# EAGLE design diskohedron4w_reve (EAGLE 7.0.0)
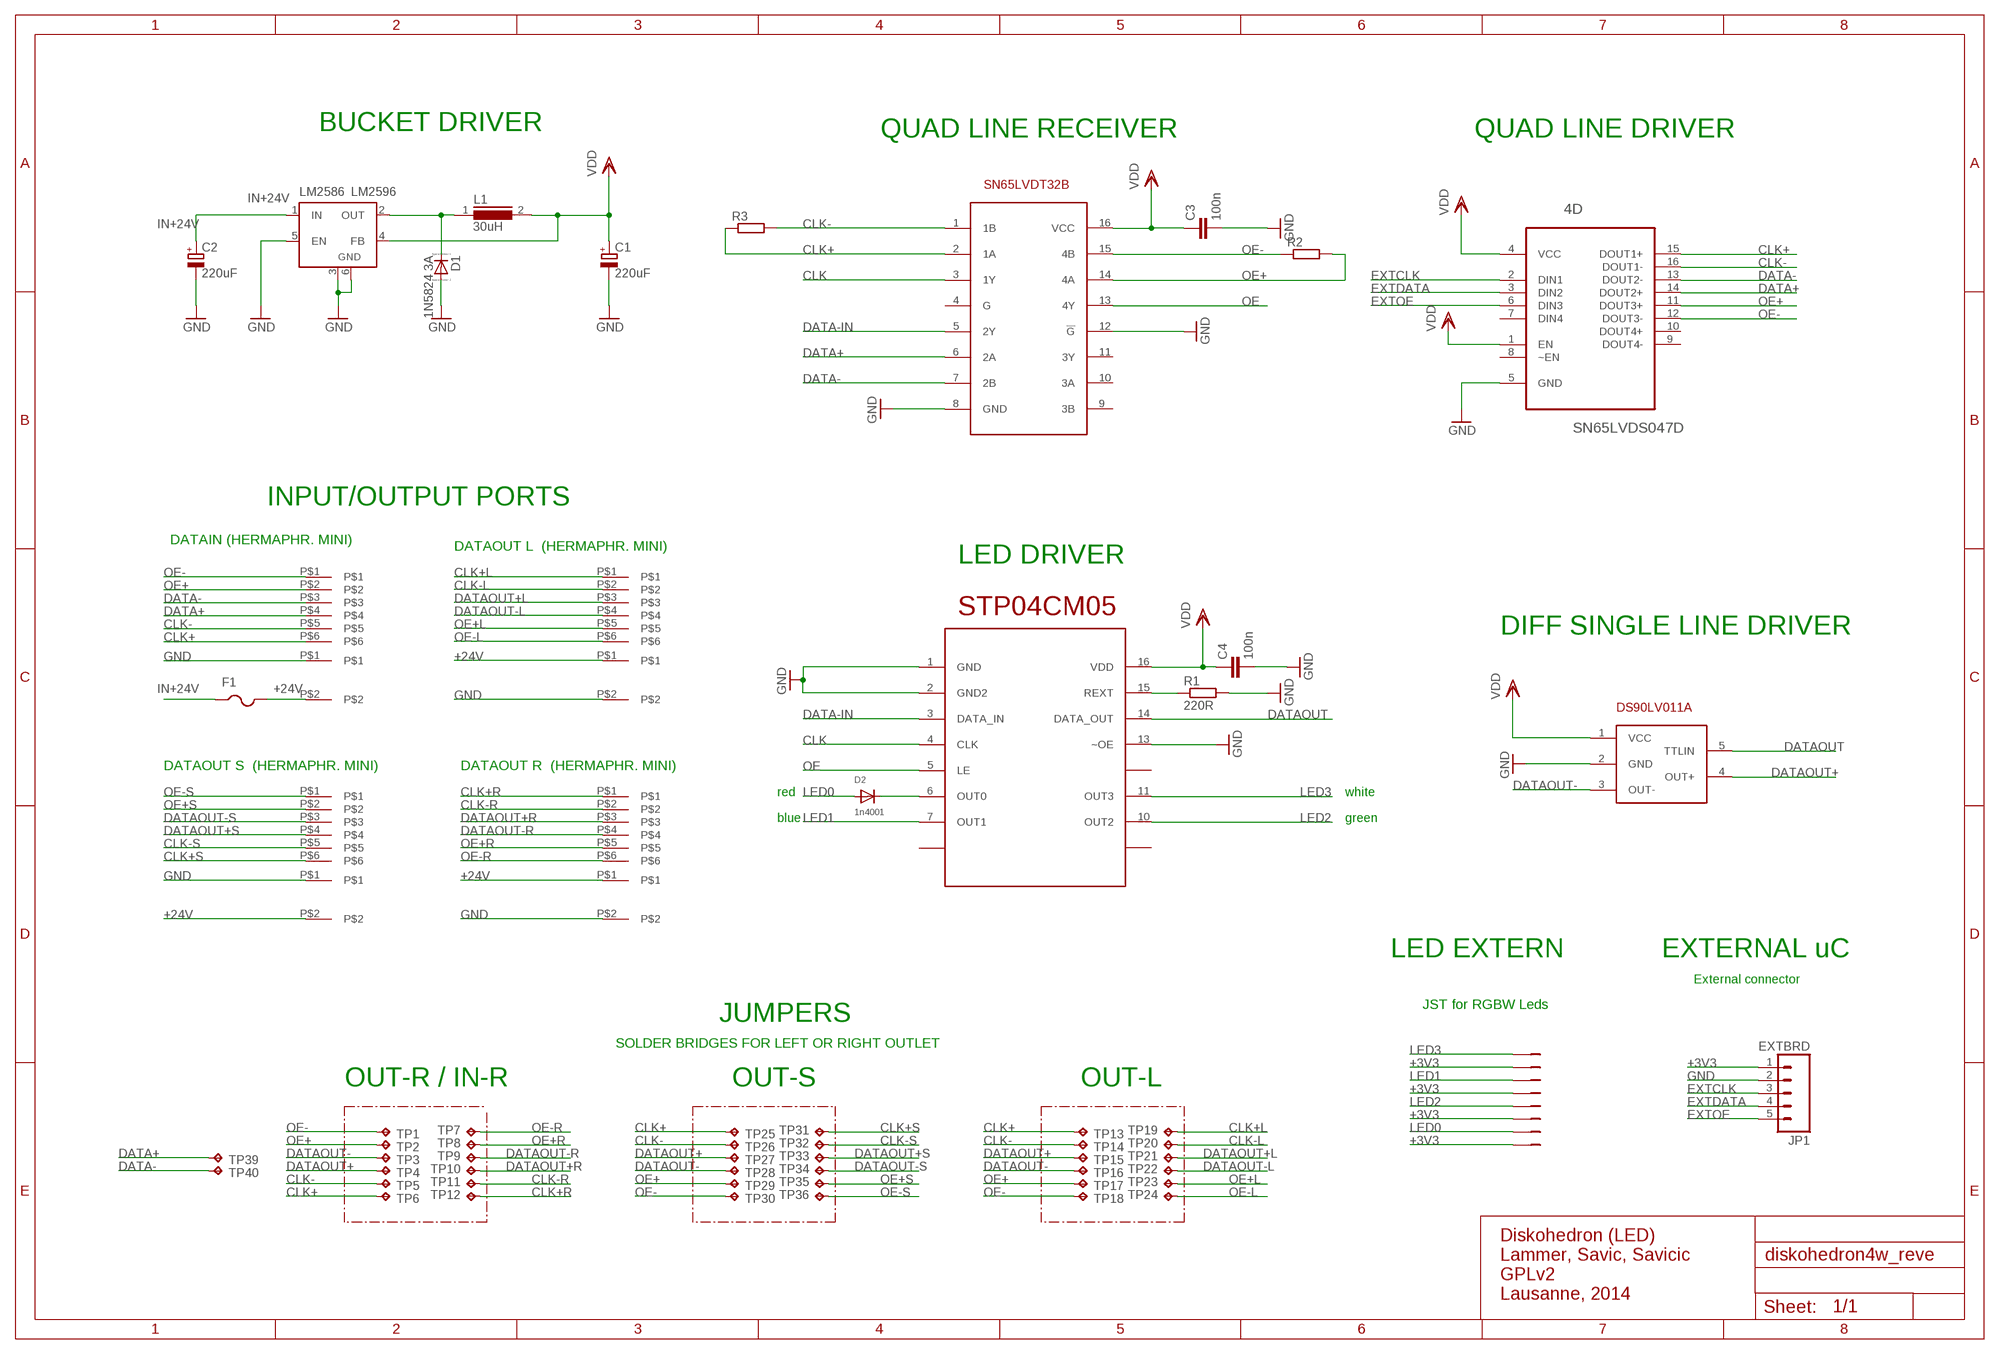
[diagram p0: schematic, sheet 1]

## Parts
1D  DS90LV011A  [SOT23-5]
4D  SN65LVDS047D  [SOIC127P600X175-16N]
4R  SN65LVDST32  [SOIC16]
C1  220uF  CPOL-EU153CLV-1010  [153CLV-1010]
C2  220uF  CPOL-EU153CLV-1010  [153CLV-1010]
C3  100n  C-EUC0805  [C0805]
C4  100n  C-EUC0805  [C0805]
D1  1N5824 3A  DIODE_E-SMC  [DIODE_SMC]
D2  1n4001  DIODESMA  [SMADIODE]
F1  PTCFUSE-1812  [1812]
IN1  HERMAPHRODITMINI6PIN  [HERMAPHRODITMINI6PIN]
JP1  EXTBRD  M05PTH  [1X05]
JST  8PIN-ZH  [B8B-ZH]
L1  30uH  DR127  [DR127]
LM2586  LM2596  LM2596S  [TO263-5]
OUT-L  HERMAPHRODITMINI6PIN  [HERMAPHRODITMINI6PIN]
OUT-R  HERMAPHRODITMINI6PIN  [HERMAPHRODITMINI6PIN]
OUT-S  HERMAPHRODITMINI6PIN  [HERMAPHRODITMINI6PIN]
POWERIN  HERMAPHRODIT2PIN  [HERMAPHRODIT2PIN]
POWEROUT-L  HERMAPHRODIT2PIN  [HERMAPHRODIT2PIN]
POWEROUT-R  HERMAPHRODIT2PIN  [HERMAPHRODIT2PIN]
POWEROUT-S  HERMAPHRODIT2PIN  [HERMAPHRODIT2PIN]
R1  220R  R-EU_M0805  [M0805]
R2  R-EU_R0603  [R0603]
R3  R-EU_R0603  [R0603]
STP04  STP04CM05  [TSSOP16]
TP1  TPTP12SQ  [TP12SQ]
TP2  TPTP12SQ  [TP12SQ]
TP3  TPTP09SQ  [TP09SQ]
TP4  TPTP09SQ  [TP09SQ]
TP5  TPTP12SQ  [TP12SQ]
TP6  TPTP12SQ  [TP12SQ]
TP7  TPTP12SQ  [TP12SQ]
TP8  TPTP12SQ  [TP12SQ]
TP9  TPTP20SQ  [TP20SQ]
TP10  TPTP20SQ  [TP20SQ]
TP11  TPTP12SQ  [TP12SQ]
TP12  TPTP12SQ  [TP12SQ]
TP13  TPTP12SQ  [TP12SQ]
TP14  TPTP12SQ  [TP12SQ]
TP15  TPTP12SQ  [TP12SQ]
TP16  TPTP12SQ  [TP12SQ]
TP17  TPTP12SQ  [TP12SQ]
TP18  TPTP12SQ  [TP12SQ]
TP19  TPTP12SQ  [TP12SQ]
TP20  TPTP12SQ  [TP12SQ]
TP21  TPTP12SQ  [TP12SQ]
TP22  TPTP12SQ  [TP12SQ]
TP23  TPTP12SQ  [TP12SQ]
TP24  TPTP12SQ  [TP12SQ]
TP25  TPTP12SQ  [TP12SQ]
TP26  TPTP12SQ  [TP12SQ]
TP27  TPTP12SQ  [TP12SQ]
TP28  TPTP12SQ  [TP12SQ]
TP29  TPTP12SQ  [TP12SQ]
TP30  TPTP12SQ  [TP12SQ]
TP31  TPTP12SQ  [TP12SQ]
TP32  TPTP12SQ  [TP12SQ]
TP33  TPTP12SQ  [TP12SQ]
TP34  TPTP12SQ  [TP12SQ]
TP35  TPTP12SQ  [TP12SQ]
TP36  TPTP12SQ  [TP12SQ]
TP39  TPTP09SQ  [TP09SQ]
TP40  TPTP09SQ  [TP09SQ]

## Nets
+3V3: 1D.1(VCC) 4D.1(EN) 4D.4(VCC) 4R.16(VCC) C1.+ C3.1 C4.1 JP1.1 JST.2 JST.4 JST.6 JST.8 L1.2 LM2586.4(FB) STP04.16(VDD) ; supply symbol labelled VDD
+24V: F1.2 POWERIN.P$2 POWEROUT-L.P$1 POWEROUT-R.P$1 POWEROUT-S.P$2
CLK: 4R.3(1Y) STP04.4(CLK)
CLK+: 4D.15(DOUT1+) 4R.2(1A) IN1.P$6 R3.1 TP6.TP TP13.TP TP25.TP
CLK+L: OUT-L.P$1 TP19.TP
CLK+R: OUT-R.P$1 TP12.TP
CLK+S: OUT-S.P$6 TP31.TP
CLK-: 4D.16(DOUT1-) 4R.1(1B) IN1.P$5 R3.2 TP5.TP TP14.TP TP26.TP
CLK-L: OUT-L.P$2 TP20.TP
CLK-R: OUT-R.P$2 TP11.TP
CLK-S: OUT-S.P$5 TP32.TP
DATA+: 4D.14(DOUT2+) 4R.6(2A) IN1.P$4 TP39.TP
DATA-: 4D.13(DOUT2-) 4R.7(2B) IN1.P$3 TP40.TP
DATA-IN: 4R.5(2Y) STP04.3(DATA_IN)
DATAOUT: 1D.5(TTLIN) STP04.14(DATA_OUT)
DATAOUT+: 1D.4(OUT+) TP4.TP TP15.TP TP27.TP
DATAOUT+L: OUT-L.P$3 TP21.TP
DATAOUT+R: OUT-R.P$3 TP10.TP
DATAOUT+S: OUT-S.P$4 TP33.TP
DATAOUT-: 1D.3(OUT-) TP3.TP TP16.TP TP28.TP
DATAOUT-L: OUT-L.P$4 TP22.TP
DATAOUT-R: OUT-R.P$4 TP9.TP
DATAOUT-S: OUT-S.P$3 TP34.TP
EXTCLK: 4D.2(DIN1) JP1.3
EXTDATA: 4D.3(DIN2) JP1.4
EXTOE: 4D.6(DIN3) JP1.5
GND: 1D.2(GND) 4D.5(GND) 4R.8(GND) 4R.12(!G) C1.- C2.- C3.2 C4.2 D1.A(C) JP1.2 LM2586.3(GND) LM2586.5(EN) LM2586.6(GND) POWERIN.P$1 POWEROUT-L.P$2 POWEROUT-R.P$2 POWEROUT-S.P$1 R1.2 STP04.1(GND) STP04.2(GND2) STP04.13(~OE)
IN+24V: C2.+ F1.1 LM2586.1(IN)
LED0: D2.A JST.7
LED1: JST.3 STP04.7(OUT1)
LED2: JST.5 STP04.10(OUT2)
LED3: JST.1 STP04.11(OUT3)
N$1: R1.1 STP04.15(REXT)
N$2: D1.C(A) L1.1 LM2586.2(OUT)
N$3: D2.C STP04.6(OUT0)
OE: 4R.13(4Y) STP04.5(LE)
OE+: 4D.11(DOUT3+) 4R.14(4A) IN1.P$2 R2.2 TP2.TP TP17.TP TP29.TP
OE+L: OUT-L.P$5 TP23.TP
OE+R: OUT-R.P$5 TP8.TP
OE+S: OUT-S.P$2 TP35.TP
OE-: 4D.12(DOUT3-) 4R.15(4B) IN1.P$1 R2.1 TP1.TP TP18.TP TP30.TP
OE-L: OUT-L.P$6 TP24.TP
OE-R: OUT-R.P$6 TP7.TP
OE-S: OUT-S.P$1 TP36.TP
Unconnected: 4D.7(DIN4) 4D.8(~EN) 4D.9(DOUT4-) 4D.10(DOUT4+) 4R.4(G) 4R.9(3B) 4R.10(3A) 4R.11(3Y) STP04.8(N.C1) STP04.9(NC) STP04.12(NC3)

## Notes on the sheet
- BUCKET DRIVER | QUAD LINE RECEIVER | QUAD LINE DRIVER
- INPUT/OUTPUT PORTS
- DATAIN (HERMAPHR. MINI)
- DATAOUT L  (HERMAPHR. MINI)
- LED DRIVER
- DIFF SINGLE LINE DRIVER
- DATAOUT S  (HERMAPHR. MINI) | DATAOUT R  (HERMAPHR. MINI)
- red | white
- blue | green
- LED EXTERN | EXTERNAL uC
- External connector
- for Arduino, etc.
- JST for RGBW Leds | not differentiated
- JUMPERS
- SOLDER BRIDGES FOR LEFT OR RIGHT OUTLET
- OUT-R / IN-R | OUT-S | OUT-L
- Diskohedron (LED)
  Lammer, Savic, Savicic
  GPLv2
  Lausanne, 2014

## Library data of the parts
1D = diskohedron:DS90LV011A: 3V LVDS Single High Speed Differential Driver
4D = Texas Instruments_By_element14_Batch_1:SN65LVDS047D: LVDS QUAD DIFFERENTIAL LINE DRIVER; MPN: SN65LVDS047D; OC_FARNELL: 8452350; OC_NEWARK: 75C7839; PACKAGE: SOIC-16; SUPPLIER: TEXAS INSTRUMENTS
4R = diskohedron:SN65LVDST32
C1 C2 = rcl:CPOL-EU: POLARIZED CAPACITOR, European symbol
C3 C4 = rcl:C-EU: CAPACITOR, European symbol
D1 = eagle-ltspice:DIODE_E-: Schottky Diode; SPICEMODEL: diode; SPICEPREFIX: D
D2 = adafruit:DIODE: Diode SMADIODE - SMA Surface Mount Package 20V 1A Schottky Diode Digikey: 641-1014-6-ND DO-1N4148 - Through Hole Small Current Diode SOD-123 20V 1 A (.5mV Vf) Schottky Diode - Digikey: MBRX120TPMSCT-ND SOD-323 10V 570mA (.38mV Vf, 3ns) Schottky Diode - Digikey: ZLLS410CT-ND SOD-523 30V 30mA Schottky Diode (RB751S-40TE61) - Digikey: RB751S-40TE61CT-ND SOT23-R/W - SOT23 Package (R = Solder Paste/Reflow Ovens, W = Hand-Soldering) BAT54Film 40V 300mA - Digikey: 497-7162-1-ND
F1 = adafruit:PTCFUSE: PTC fuses, resettable thermistors
IN1 OUT-L OUT-R OUT-S = diskohedron:HERMAPHRODITMINI6PIN: MINIATURE HERMAPHRODITIC (6P) 1971567-3 TE Internal Number: 1971567-3 http://www.te.com/catalog/bin/TE.Connect?S=29506&M=PPROP&P=&BML=&LG=1&PG=1&IDS=517146,517147,517148&N=3
JP1 = SparkFun-Connectors:M05: Header 5 Standard 5-pin 0.1" header. Use with straight break away headers (SKU : PRT-00116), right angle break away headers (PRT-00553), swiss pins (PRT-00743), machine pins (PRT-00117), and female headers (PRT-00115). Molex polarized connector foot print use with SKU : PRT-08230 with associated crimp pins and housings.
JST = diskohedron:8PIN-ZH
L1 = inductors:DR127: High Power Density, High Efficiency, Shielded Inductors Source: coiltronics_dr_series.pdf
LM2586 = linear:LM2596S: STEP-DOWN VOLTAGE REGULATOR
POWERIN POWEROUT-L POWEROUT-R POWEROUT-S = diskohedron:HERMAPHRODIT2PIN: Hermaphroditic Blade and Receptacle Connectors TE Internal Number: 1954289-1 http://www.te.com/catalog/pn/en/1954289-1?RQPN=1954289-1
R1 = resistor:R-EU_: RESISTOR, European symbol
R2 R3 = rcl:R-EU_: RESISTOR, European symbol
STP04 = stp04:STP04CM05
TP1-TP36 TP39 TP40 = testpad:TP: Test pad

## Board
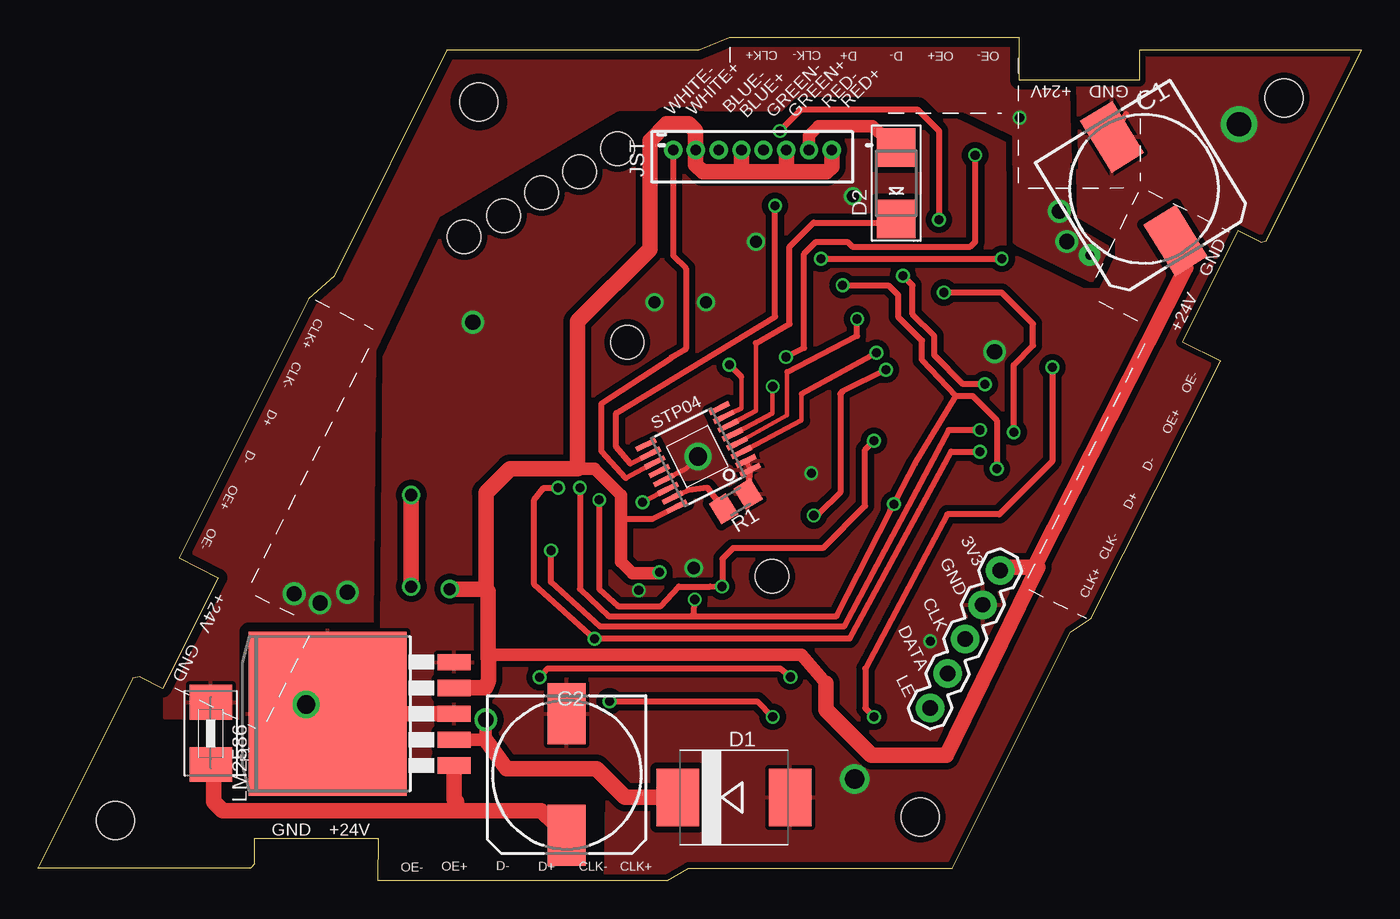
[diagram p1: board, top side]
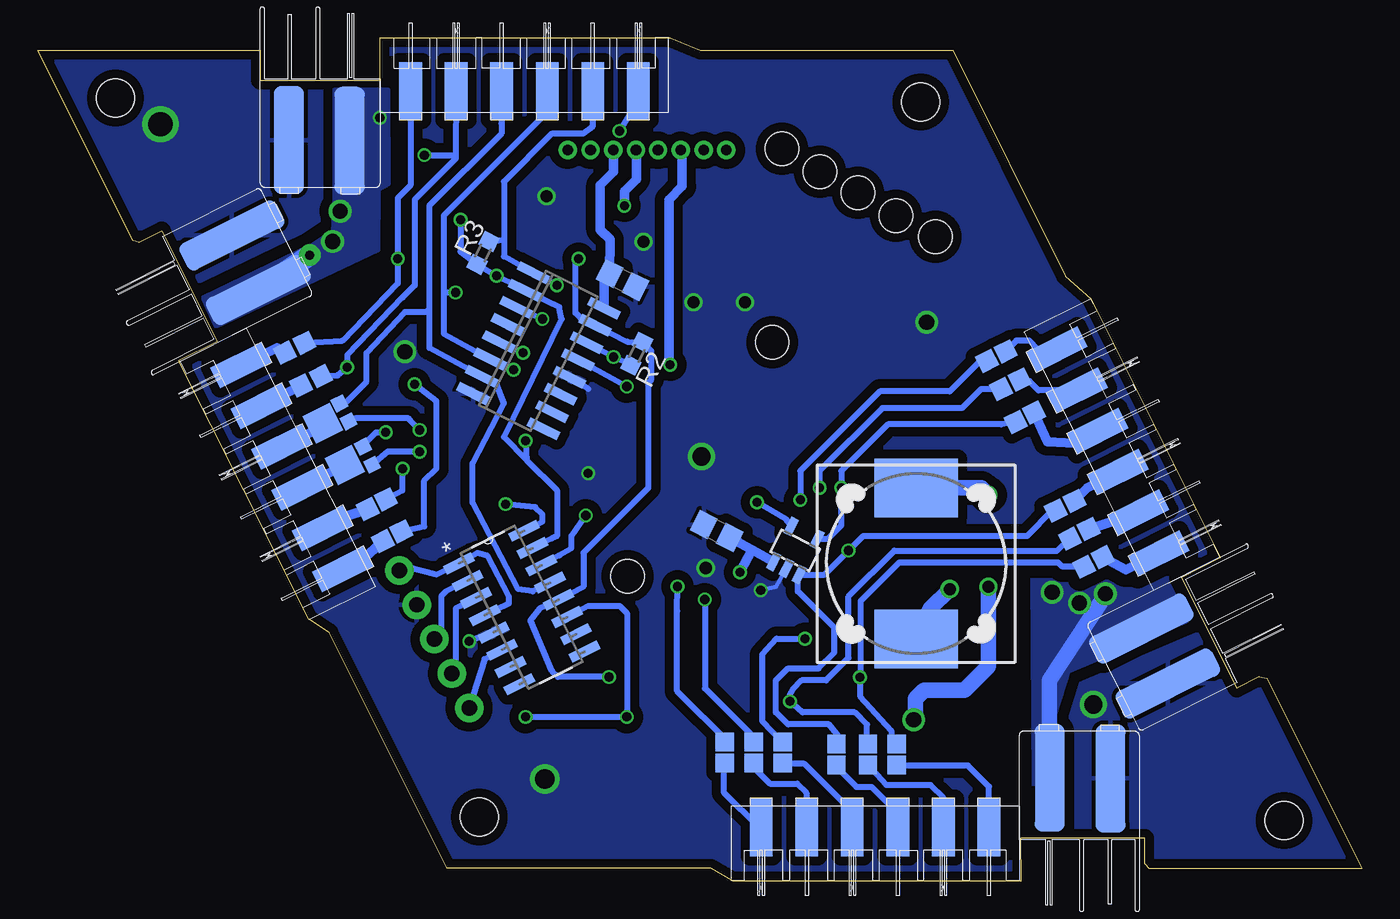
[diagram p2: board, bottom side, seen from below]

Size 87.17 x 55.48 mm. Coordinates in mm from the lower left corner, seen from the top.
Outline: 72.54,54.68 87.17,54.68 80.9,42.13 80.52,42.03 79.02,42.78 75.38,35.48 77.9,34.23 69.35,17.25 68,16.35 60.23,0.8 42.84,0.8 41.43,0 22.42,0 22.44,2.77 14.27,2.78 14.27,1.1 14.01,0.8 0,0.8 6.25,13.33 6.72,13.43 8.22,12.68 11.88,19.95 9.3,21.25 17.83,38.3 19.5,39.8 26.93,54.68 43.55,54.68 45.55,55.48 64.63,55.48 64.63,52.7 72.54,52.7 72.54,54.68
Copper layers (1*16): Top 0.035mm / dielectric 1.5mm / Bottom 0.035mm
Design rules "ITEADstudio_DRC": minimum track width 6mil, minimum drill 12mil, track to track 6mil, track to pad 6mil, pad to pad 6mil, via to via 6mil, smd to smd 0mil, copper to edge 10mil, drill to drill 10mil, minimum pad ring 10mil, minimum via ring 6mil, stop-mask expansion 2mil, vias tented up to drill 100mil, thermal gap 10mil
Holes 2.5 mm at 5.1,3.95 82.06,51.53 29.03,51.26 58.11,4.2
Holes 2.2 mm at 38.81,35.45 48.35,20.03 30.68,43.78 33.18,45.28 35.68,46.68 38.18,48.18 28.08,42.38
Milling: 31 lines

### Footprints (pad centres in the part's own frame; a part is rotated, then mirrored left to right if it is on the bottom)
SOT23-5 = smd 0.55 x 1.2: 1 -0.95,-1.3; 2 0,-1.3; 3 0.95,-1.3; 4 0.95,1.3; 5 -0.95,1.3
SOIC127P600X175-16N = smd 2.057 x 0.61: 1 -4.801,8.89; 2 -4.801,7.62; 3 -4.801,6.35; 4 -4.801,5.08; 5 -4.801,3.81; 6 -4.801,2.54; 7 -4.801,1.27; 8 -4.801,0; 9 0,0; 10 0,1.27; 11 0,2.54; 12 0,3.81; 13 0,5.08; 14 0,6.35; 15 0,7.62; 16 0,8.89
SOIC16 = smd 0.6 x 2.2: 1 -4.445,-2.6; 2 -3.175,-2.6; 3 -1.905,-2.6; 4 -0.635,-2.6; 5 0.635,-2.6; 6 1.905,-2.6; 7 3.175,-2.6; 8 4.445,-2.6; 9 4.445,2.6; 10 3.175,2.6; 11 1.905,2.6; 12 0.635,2.6; 13 -0.635,2.6; 14 -1.905,2.6; 15 -3.175,2.6; 16 -4.445,2.6
153CLV-1010 = smd 4 x 2.5: + 4,0; - -4,0
C0805 = smd 1.3 x 1.5: 1 -0.95,0; 2 0.95,0
DIODE_SMC = smd 2.8 x 3.8: A 3.7,0; C -3.7,0
SMADIODE = smd 2.54 x 2.54: A 2.349,0; C -2.349,0
1812 = smd 2.286 x 2.794: 1 -2.046,0; 2 2.046,0
HERMAPHRODITMINI6PIN = smd 1.5 x 3.8: P$1 1.996,1.406; P$2 4.997,1.406; P$3 7.997,1.406; P$4 10.997,1.406; P$5 13.997,1.406; P$6 16.997,1.406
1X05 = drill 1.016 pad 1.88: 1 0,0; 2 2.54,0; 3 5.08,0; 4 7.62,0; 5 10.16,0
B8B-ZH = drill 0.7 pad 1.1: 1 -2.25,0; 2 -0.75,0; 3 0.75,0; 4 2.25,0; 5 3.7,0; 6 5.2,0; 7 6.7,0; 8 8.2,0
DR127 = smd 3.85 x 5.5: 1 -4.975,0; 2 4.975,0
TO263-5 = smd 1.067 x 2.159: 1 -3.404,-5.791; 2 -1.702,-5.791; 3 0,-5.791; 4 1.702,-5.791; 5 3.404,-5.791 | smd 10.8 x 10.41: 6 0,2.54
HERMAPHRODIT2PIN = smd 2 x 7.1: P$1 1.9,3.5; P$2 5.9,3.45
M0805 = smd 1.3 x 1.6: 1 -0.95,0; 2 0.95,0
R0603 = smd 1 x 1.1: 1 -0.85,0; 2 0.85,0
TSSOP16 = smd 0.35 x 1.43: 1 -2.275,-2.7; 2 -1.625,-2.7; 3 -0.975,-2.7; 4 -0.325,-2.7; 5 0.325,-2.7; 6 0.975,-2.7; 7 1.625,-2.7; 8 2.275,-2.7; 9 2.275,2.7; 10 1.625,2.7; 11 0.975,2.7; 12 0.325,2.7; 13 -0.325,2.7; 14 -0.975,2.7; 15 -1.625,2.7; 16 -2.275,2.7
TP12SQ = smd 1.2 x 1.2: TP 0,0
TP09SQ = smd 0.9 x 0.9: TP 0,0
TP20SQ = smd 2 x 2: TP 0,0

### Placement (x,y rotation side)
1D  37.29,21.74 333.4 bottom
4D  51.18,15.08 26.6 bottom
4R  54.22,34.88 243.4 bottom
C1  72.83,45.56 301.5 top
C2  34.82,6.98 270 top
C3  48.68,39.53 333.4 bottom
C4  42.47,23.02 153.4 bottom
D1  45.84,5.47 0 top
D2  56.53,45.91 90 top
F1  11.38,9.69 90 top
IN1  64.63,50.58 0 bottom
JP1  63.38,20.42 243 top
JST  44.08,48.09 0 top
L1  29.34,20.88 270 bottom
LM2586  21.62,10.98 90 top
OUT-L  22.23,36.12 296.6 bottom
OUT-R  64.93,19.37 116.6 bottom
OUT-S  22.54,4.91 180 bottom
POWERIN  72.54,45.26 0 bottom
POWEROUT-L  18.49,16.72 296.6 bottom
POWEROUT-R  68.67,38.75 116.6 bottom
POWEROUT-S  14.64,10.23 180 bottom
R1  45.96,24.97 31.5 top
R2  47.74,34.7 243 bottom
R3  57.86,41.32 63 bottom
STP04  43.48,27.87 116.6 top
TP1  69.61,35.41 206.6 bottom
TP2  68.53,33.21 206.6 bottom
TP3  66.71,30.24 206.6 bottom
TP4  65.16,27.38 206.6 bottom
TP5  64.25,25.1 206.6 bottom
TP6  63.24,23 206.6 bottom
TP7  70.92,34.77 206.6 bottom
TP8  69.85,32.6 206.6 bottom
TP9  68.42,30.11 206.6 bottom
TP10  66.97,27.37 206.6 bottom
TP11  65.46,24.46 206.6 bottom
TP12  64.44,22.36 206.6 bottom
TP13  24.67,34.22 26.6 bottom
TP14  23.74,32.36 26.6 bottom
TP15  22.77,30.19 26.6 bottom
TP16  20.14,24.37 26.6 bottom
TP17  19.21,22.52 26.6 bottom
TP18  18.28,20.67 26.6 bottom
TP19  23.43,34.85 26.6 bottom
TP20  22.51,32.99 26.6 bottom
TP21  21.58,30.82 26.6 bottom
TP22  18.9,25 26.6 bottom
TP23  17.97,23.15 26.6 bottom
TP24  17.04,21.3 26.6 bottom
TP25  41.94,9.13 90 bottom
TP26  40.03,9.13 90 bottom
TP27  38.13,9.13 90 bottom
TP28  34.58,9 90 bottom
TP29  32.52,9 90 bottom
TP30  30.61,9 90 bottom
TP31  41.94,7.75 270 bottom
TP32  40.03,7.75 270 bottom
TP33  38.13,7.75 270 bottom
TP34  34.58,7.61 270 bottom
TP35  32.52,7.61 270 bottom
TP36  30.61,7.61 270 bottom
TP39  65.77,28.57 206.6 bottom
TP40  67.31,31.42 206.6 bottom

### Tracks (layer width: path | path; a pad name or v marks a point on that pad's centre or on a via)
+3V3  (via drill 0.6, 0.8)
  Top 0.406: STP04.16 40.46,23.8 38.71,23.8 38.39,23.48
  Top 0.61: 43.23,48.4 JST.2
  Top 0.813: 35.54,27.13 36.65,27.13 38.39,25.38 38.39,23.48 38.39,21 39.15,20.24 40.87,20.24 v40.93,20.3 | 51.89,13 50.29,14.85 29.78,14.85
  Top 1.016: C1.+ 75.6,40.34 65.66,20.72 65.86,20.62 | 29.5,19.19 29.5,25.54 31.09,27.13 35.54,27.13 35.54,36.81 40.3,41.58 40.3,48.72 41.41,49.83 42.84,49.83 43.31,49.36 43.31,48.11 JST.2 | 65.86,20.62 63.58,20.62 JP1.1 | 65.86,20.62 59.82,8.24 54.9,8.24 51.89,11.26 51.89,13 | JST.2 43.31,48.07 43.31,47.13 43.79,46.66 46.4,46.66 | 46.4,46.66 49.28,46.66 | 49.28,46.66 51.95,46.66 52.28,46.99 JST.8 | JST.8 | JST.4 46.33,46.72 46.4,46.66 | JST.6 49.28,46.66 | JST.2 | v27.12,19.19 29.5,19.19 | 29.5,19.19 29.66,19.03 29.66,14.65 29.78,14.85 29.68,14.55 29.68,13.18 29.48,12.68 LM2586.4
  Bottom 0.406: 4D.4 56.17,18.24 56.17,18.72 57.6,21.42 58.24,21.57 4D.1 60.94,20.15 62.84,20.62 | 41.09,22.37 C4.1
  Bottom 0.61: 4R.16 49.9,39.58 C3.1 49.51,42.21 50.14,42.85 50.14,45.8 49.28,46.66 JST.6 | 62.84,20.62 JP1.1 | 41.09,22.37 40.93,22.21 40.15,21.78 | 40.15,21.78 1D.1 | v40.93,20.3 40.15,21.78
  Bottom 1.016: L1.2 28.39,17.93 v27.12,19.19
  Bottom 1.27: 29.5,14.78 L1.2
+24V  (via drill 0.6, 0.6 pad 1.42, 1)
  Bottom 1.016: POWEROUT-S.P$2 20.58,13.18 17.08,18.48
  Bottom 1.422: POWEROUT-R.P$1 v69.27,41.18
  other vias: 64.66,50.23 18.58,18.28 20.38,18.98 16.88,18.88 67.27,44.08 67.77,42.08
  pour Top (isolate 0.61): 67.77,54.18 67.97,47.33 61.08,50.65 38.18,50.78 26.33,43.74 22.13,34.93 21.97,16.97 22.24,5.3 14.57,12.18 13.47,10.73 8.38,10.73 8.38,12.78 7.07,13.38 10.78,20.78 8.67,21.88 16.88,38.68 19.98,39.68 27.08,54.38 43.88,54.38 45.77,55.43 64.47,55.43 64.47,54.18
  pour Bottom (isolate 0.813, no thermals): 12.36,20.78 15.53,19.51 16.8,20.31 21.7,20.15 21.6,6.3 19.27,13.8 11.09,17.29
  pour Bottom (no thermals): 67.62,52.07 67.62,46.18 67.64,44.38 67.72,42.8 69.26,41.75 76.29,38.39 75.44,36.49 64.77,41.52 64.72,45.5 64.1,45.9 64.1,52.06
  pour Top (isolate 0.813): 64.26,52.16 64.3,42 69.4,39.49 70.48,41.69 67.92,43.17 67.88,46.18 67.88,51.78
CLK  (via drill 0.6)
  Top 0.305: STP04.4 49.35,30.62 49.35,33.48
  Top 0.406: 49.35,33.48 53.95,35.86 v53.95,36.97
  Bottom 0.406: v53.95,36.97 4R.3
CLK+  (via drill 0.6, 0.6 pad 0.61)
  Top 0.406: v48.87,49.36 50.3,50.78 57.92,50.78 59.35,49.36 v59.35,43.51 | v62.36,32.69 60.94,32.69 59.03,34.59 59.03,35.86 57.6,37.29 57.6,39.2 v56.97,39.83 | v36.96,25.07 36.96,19.19 38.19,18.06 41.01,18.06 42.2,19.36 44.27,19.36 v45.06,19.36 v45.08,19.38 45.08,21.18 45.79,21.89 51.69,21.89 54.48,24.68 54.48,28.37 v55.07,28.96
  Bottom 0.406: IN1.P$6 47.54,51.9 47.54,51.52 v48.87,49.36 | 54.98,27.69 53,25.7 53,22.69 53.32,22.53 4D.15 | 54.98,27.69 56.49,29.19 52.68,36.97 52.84,37.77 4R.2 55.57,39.12 | TP6.TP 61.73,23.32 61.73,26.34 60.94,27.13 60.94,31.58 v62.36,32.69 | 56.01,39.35 55.57,39.12 | v55.07,28.96 55.07,28.8 54.98,27.69 | TP13.TP 25.12,34.22 27.12,32.21 31.73,32.21 36.96,26.97 v36.96,25.07 | v59.35,43.51 59.35,41.42 R3.1 v56.97,39.83 55.57,39.12 | 45.24,19.24 v45.06,19.36 45.08,17.75 45.08,12.48 41.67,9.08 TP25.TP 41.97,9.18 41.98,9.18
CLK+L
  Bottom 0.406: OUT-L.P$1 21.3,34.96 21.88,35.54 22.74,35.54 TP19.TP
CLK+R
  Bottom 0.406: 65.86,21.1 OUT-R.P$1
  Bottom 0.61: TP12.TP 65.86,21.1
CLK+S
  Bottom 0.406: OUT-S.P$6 39.7,3.5 41.98,5.78 41.98,7.71 TP31.TP
CLK-  (via drill 0.6, 0.6 pad 0.61)
  Top 0.406: 43.16,17.41 37.58,17.41 35.69,19.19 v35.69,25.86 | 43.16,17.41 52.6,17.41 56.15,24.36 | 56.15,24.36 57.76,27.45 60.46,31.89 | v63.16,27.12 63.16,30.31 61.57,31.89 60.46,31.89 | v53,39.2 56.01,39.2 56.65,38.56 56.65,37.13 58.24,35.54 58.24,34.27 60.46,31.89 | v43.26,18.51 43.16,17.41 | v56.38,24.79 56.21,24.49 56.15,24.36
  Bottom 0.406: IN1.P$5 50.63,50.94 50.62,50.93 50.62,49.67 51.25,49.2 53.32,49.2 56.49,46.02 56.49,42.18 | v53,39.2 4R.1 56.49,41.1 56.49,42.18 | TP5.TP 63.17,25.69 v63.16,27.12 | 4D.16 53.95,23.64 53.95,24.11 54.43,24.59 v56.38,24.79 | TP14.TP 25.07,32.36 26.33,31.1 31.57,31.1 35.69,26.97 v35.69,25.86 | TP26.TP 40.03,9.43 43.26,12.66 v43.26,18.51 | R3.2 56.49,42.18
CLK-L
  Bottom 0.406: 18,32.75 OUT-L.P$2 21.28,32.28 21.88,32.88 22.39,32.88 TP20.TP
CLK-R
  Bottom 0.406: 66.97,23.96 OUT-R.P$2
  Bottom 0.61: TP11.TP 66.97,23.96
CLK-S
  Bottom 0.406: TP32.TP 40.03,7.43 38.98,6.38 37.18,6.38 36.58,5.78 36.58,3.54 OUT-S.P$5
DATA+  (via drill 0.6)
  Top 0.406: v55.86,33.64 53,32.21 52.84,32.05 52.84,25.57 51.41,24.14 v51.09,24.04 | v64.27,29.51 64.27,33.96 65.54,35.23 65.54,36.66 63.48,38.72 v59.66,38.72
  Bottom 0.406: IN1.P$4 53.42,51.07 | 53.42,51.07 53.32,50.63 53.32,50.31 | v55.86,33.64 4R.6 60.46,36.02 60.46,38.72 | 4D.14 52.84,21.42 52.05,21.89 52.05,22.69 v51.09,24.04 | 53.42,51.07 53.79,50.7 53.79,50.45 60.46,43.78 60.46,38.72 | TP39.TP 65.71,28.7 64.9,29.51 v64.27,29.51 | v59.66,38.72 60.46,38.72
DATA-
  Bottom 0.406: 4D.13 54.59,19.03 55.54,19.19 58.55,24.91 58.55,27.45 56.49,31.42 56.97,32.69 4R.7 61.41,35.07 61.41,37.61 | IN1.P$3 56.65,49.83 56.65,49.18 61.41,44.42 61.41,37.61 | TP40.TP 67.02,31.37 65.54,32.85 65.54,34.75 63,37.45 61.57,37.45 61.41,37.61
DATA-IN  (via drill 0.6)
  Top 0.305: STP04.3 50.3,30.31 50.3,32.05
  Top 0.406: 50.3,32.05 v55.22,34.75
  Bottom 0.406: v55.22,34.75 4R.5
DATAOUT  (via drill 0.6)
  Top 0.305: 39.88,24.94 v39.82,24.91 39.68,24.75 39.88,24.94 | 39.88,24.94 STP04.14
  Bottom 0.406: 1D.5 37.92,23.8 v39.82,24.91
DATAOUT+  (via drill 0.6)
  Top 0.406: v62.05,28.24 60.14,28.24 53.46,15.92 v36.66,15.92 32.68,19.51 32.68,25.07 33.31,25.86 v34.27,25.86
  Bottom 0.406: TP15.TP 23.74,30.03 31.2,30.03 34.27,26.97 v34.27,25.86 34.27,23.39 35.18,22.48 1D.4 35.86,22.68 | v62.05,28.24 64.14,28.24 TP4.TP | v36.66,15.92 38.53,15.92 39.48,14.88 39.48,10.52 TP27.TP
DATAOUT+L
  Bottom 0.61: OUT-L.P$3 17.51,29.6 18.91,28.8 20.7,28.9 TP21.TP
DATAOUT+R
  Bottom 0.61: TP10.TP OUT-R.P$3
DATAOUT+S
  Bottom 0.406: OUT-S.P$4 33.54,4.54 36.68,7.68 38.06,7.68 TP33.TP
DATAOUT-  (via drill 0.6)
  Top 0.406: v33.79,21.73 33.79,19.67 37.04,16.72 53.08,16.72 59.98,29.67 v62.05,29.67
  Bottom 0.406: TP16.TP 20.36,24.37 22.04,22.69 32.84,22.69 v33.79,21.73 | 33.79,21.57 v33.79,21.73 | v33.79,21.73 35.37,20.15 1D.3 37.12,20.05 37.12,19.03 34.72,16.64 34.72,15.01 35.76,13.98 37.77,13.98 38.58,13.18 38.58,11.08 37.77,10.28 35.08,10.28 34.3,9.3 TP28.TP | v62.05,29.67 62.65,30.28 62.65,30.3 62.77,30.43 66.25,30.43 TP3.TP
DATAOUT-L
  Bottom 0.61: TP22.TP 18.07,25.86 OUT-L.P$4
DATAOUT-R
  Bottom 0.61: TP9.TP 69.19,29.51 OUT-R.P$4
DATAOUT-S
  Bottom 0.406: TP34.TP 34.61,7.58 34.61,7.51 33.27,6.18 32.27,6.18 30.68,4.58 30.68,3.64 OUT-S.P$3
EXTCLK
  Bottom 0.406: 4D.2 60.3,19.03 60.62,18.72 60.62,16.35 JP1.3
EXTDATA
  Bottom 0.406: 4D.3 59.35,18.08 59.66,17.92 59.66,13.89 JP1.4
EXTOE
  Bottom 0.406: 4D.6 57.76,14.59 JP1.5
GND  (via drill 0.6, 0.8, 1, 1.2, 1.2 pad 0.61, 1.3 pad 0.81, 1.6)
  Top 0.305: STP04.2 STP04.1 | STP04.13 42.68,27.13 v43.47,27.92
  Top 0.406: C1.- 71.68,50.47 | R1.2 STP04.1
  Top 1.016: LM2586.3 LM2586.6
  Top 1.422: LM2586.6 17.01,10.94 v17.66,11.59
  Bottom 0.305: 1D.2 38.55,19.35 v39.57,19.12
  Bottom 0.406: 50.93,32.37 4R.12 | 4D.5 v58.77,15.75
  other vias: 79.1,49.8 53.8,6.69 50.93,26.81 63.02,34.83 40.62,38.09 44.01,38.09 28.64,36.76 47.28,42.05 43.19,20.58 53.68,45.05
  pour Top (isolate 0.406, rank 3): 37.4,-0.3 60.18,-0.22 68.47,15.68 72.07,16.58 80.47,33.28 78.77,34.98 81.77,41.38 84.38,45.48 88.88,55.48 72.77,55.28 71.57,55.78 68.27,55.88 68.06,46.34 65.07,51.08 39.77,50.38 26.48,43.68 15.88,22.88 15.24,21.68 12.02,15.61 11.87,7.18 26.28,7.28 37.5,7.44
  pour Bottom (isolate 0.61, rank 3): -0.43,0.28 89.38,0.28 89.38,57.38 -0.43,57.38
IN+24V
  Top 1.016: 27.58,4.58 33.12,4.58 C2.+ | LM2586.1 27.41,5.35 27.58,5.18 27.58,4.58 | 27.58,4.58 12.17,4.58 11.57,5.18 11.57,7.04 F1.1
LED0
  Top 0.406: D2.A 55.55,48.1
  Top 0.813: JST.7 50.77,49.04 51.41,49.67 54.96,49.67 D2.A
LED1  (via drill 0.6)
  Top 0.305: STP04.7 46.33,31.1 46.33,33.16
  Top 0.406: v45.54,33.96 46.33,33.16
  Bottom 0.406: 45.63,34.05 v45.54,33.96
  Bottom 0.61: 45.63,34.05 45.63,44.82 44.74,45.7 44.74,48 JST.3
LED2  (via drill 0.6)
  Top 0.305: STP04.10 39.03,27.45
  Top 0.406: 39.03,27.45 38.08,28.56 38.08,30.78 48.55,37.13 v48.55,44.43
  Bottom 0.406: 47.76,48.23 JST.5
  Bottom 0.61: v48.55,44.43 48.55,45.39 47.76,46.18 47.76,48.23
LED3
  Top 0.305: STP04.11 38.71,26.5
  Top 0.406: 38.71,26.5 37.12,28.24 37.12,31.42 41.73,34.43 42.63,34.96 42.68,35.01 42.68,40.31 41.83,41.15 JST.1
N$1
  Top 0.305: 42.84,25.7 STP04.15
  Top 0.406: R1.1 44.11,25.86 42.84,25.7
N$2  (via drill 0.8, 1 pad 0.61)
  Top 0.813: LM2586.2 28.98,9.28 29.48,9.28 29.48,10.56 v29.5,10.59
  Top 1.016: v24.58,25.38 v24.58,19.35 | D1.C 38.68,5.47 36.77,7.38 30.88,7.38 29.48,9.28
  Bottom 0.406: 24.28,25.53 v24.58,25.38
  Bottom 1.016: v24.58,19.35 24.58,14.11 26.17,12.53 28.83,12.53 29.38,11.98 29.38,10.71 v29.5,10.59 | L1.1 25.05,25.85 v24.58,25.38
N$3
  Top 0.305: STP04.6 47.28,30.94 47.28,35.39
  Top 0.406: 47.28,35.39 49.51,36.66 49.51,41.74 51.09,43.32 56.3,43.32 D2.C
OE  (via drill 0.6)
  Top 0.305: STP04.5 48.39,30.78 v48.39,32.53
  Bottom 0.406: v48.39,32.53 4R.13
OE+  (via drill 0.6, 0.6 pad 0.61)
  Top 0.406: v66.81,33.8 66.81,27.61 63.32,24.11 59.89,24.11 54.49,13.95 54.49,11.35 v55.06,10.78 | v37.64,11.8 47.38,11.8 v48.39,10.78 | v61.73,47.77 61.73,42.05 61.41,41.74 53.63,41.74 53.32,42.05 51.25,42.05 50.46,41.26 50.46,35.07 v49.27,34.47
  Bottom 0.406: 4R.14 v49.27,34.47 R2.2 | IN1.P$2 59.66,47.76 | 59.66,47.76 59.66,47.53 62.36,44.83 62.36,39.2 63.16,38.4 66.81,34.59 v66.81,33.8 67.44,33.27 TP2.TP | v61.73,47.77 59.66,47.76 | TP17.TP 20.04,21.73 30.77,21.73 33.79,18.72 33.79,14.66 35.27,13.18 36.88,13.18 37.48,12.58 37.68,12.23 v37.64,11.8 36.82,11.08 33.38,11.08 32.57,10.28 32.57,9.36 TP29.TP | v55.06,10.78 v48.39,10.78 48.39,17.61 48.87,18.08 50.93,18.08 4D.11
OE+L
  Bottom 0.61: 14.87,24.29 OUT-L.P$5 TP23.TP
OE+R
  Bottom 0.61: TP8.TP OUT-R.P$5
OE+S
  Bottom 0.406: OUT-S.P$2 27.54,5.44 28.39,6.29 31.3,6.29 TP35.TP
OE-  (via drill 0.6)
  Top 0.406: 49.39,13.48 v49.56,13.41 48.88,13.98 33.58,13.98 v33.04,13.38 | v51.57,40.94 v63.48,40.94
  Bottom 0.406: IN1.P$1 62.63,45.78 63.48,44.93 v63.48,40.94 63.48,39.31 67.12,35.55 TP1.TP | TP18.TP 19.7,20.67 19.98,20.94 30.46,20.94 33,18.4 33,13.64 v33.04,13.38 33.04,12.14 30.98,9.88 30.98,9.37 TP30.TP | v49.56,13.41 52.93,13.41 53.32,13.8 54.74,17.13 54.11,17.92 4D.12 51.25,19.35 51.25,21.57 46.97,25.86 46.97,32.79 46.77,32.98 46.77,34.87 R2.1 48.38,35.48 4R.15 51.39,37.05 51.45,37.05 51.77,37.38 51.77,40.74 v51.57,40.94
OE-L
  Bottom 0.61: TP24.TP 15.53,20.46 OUT-L.P$6
OE-R
  Bottom 0.61: TP7.TP 71.41,35.07 OUT-R.P$6
OE-S
  Bottom 0.406: OUT-S.P$1 24.54,6.19 25.91,7.57 30.56,7.57
  Bottom 0.813: 30.56,7.57 TP36.TP

### Text on the board
tPlace: +24V | GND | GND | +24V | +24V | GND | GND | +24V
tNames: CLK+ | CLK- | D+ | D- | OE+ | OE- | WHITE- | WHITE+ | BLUE- | RED- | RED+ | BLUE+ | GREEN- | GREEN+ | CLK+ | CLK- | OE- | D+ | STP04 | OE+ | D- | D- | OE+ | D+ | OE- | 3V3 | CLK- | GND | CLK+ | CLK | DATA | LE | D- | OE- | OE+ | D+ | CLK- | CLK+
bSilk: INPUT | GND | +24V | GND | OUT-L | DISKO / HEDRON | * | SAVIC / LAMMER / SAVICIC | +24V | * | +24V | IN-R / OUT-R | GND | +24V | GND | rev.E | OUT-S | 03/2015
geo-helper: rotation angles: / 63.4 / 26.6